# Altium schematic sheet Sheet1.SchDoc
size A
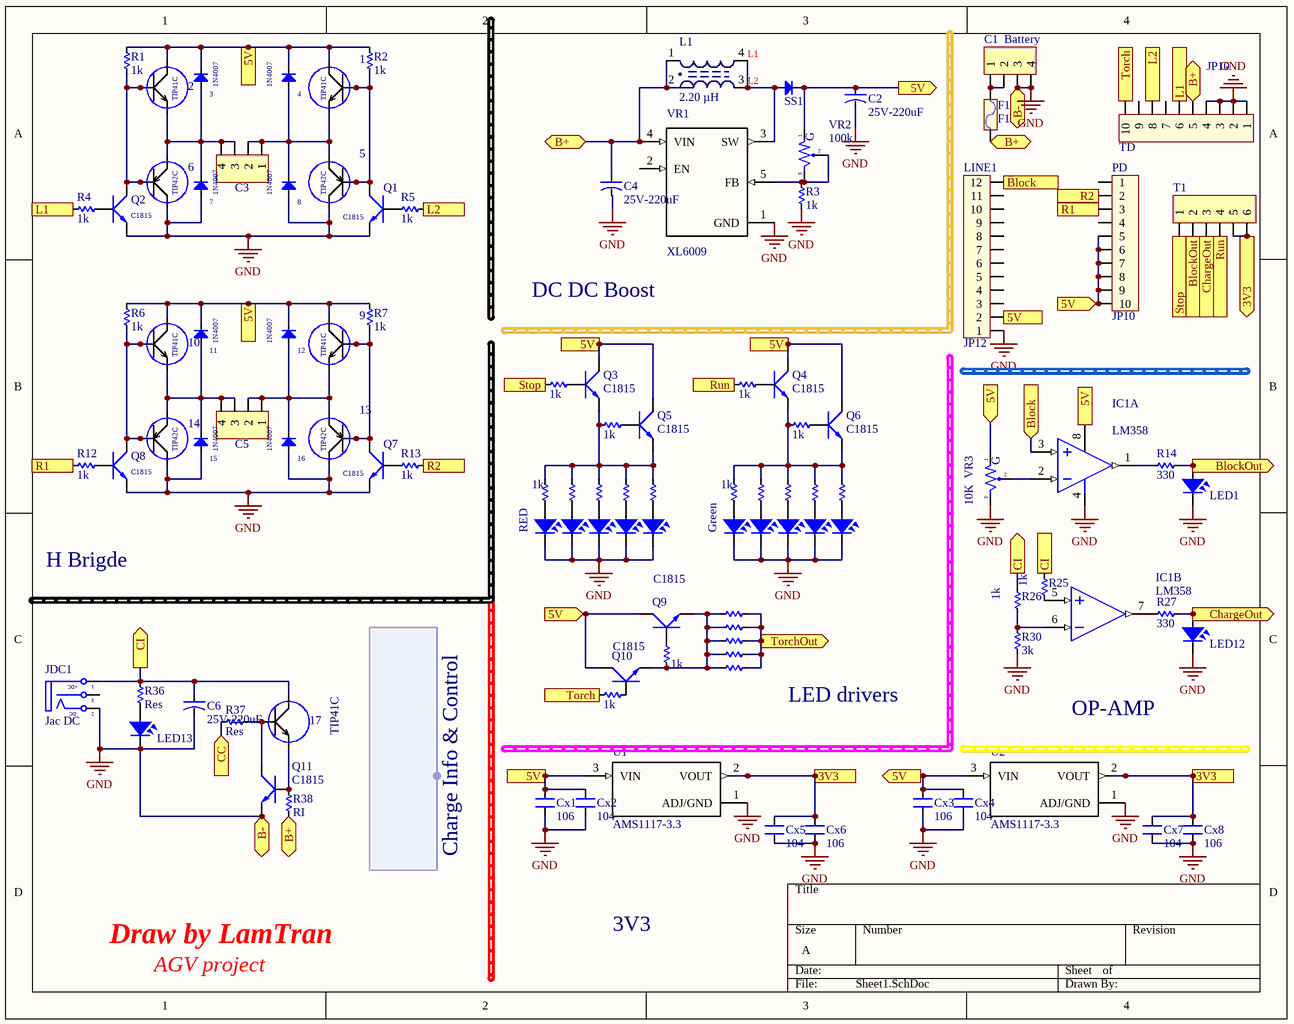
[diagram p0: Sheet1.SchDoc]

## Parts
1  TIP41C  [SC_TO-252AA]
2  TIP41C  [SC_TO-252AA]
3  1N4007  [DIO-SMD-106]
4  1N4007  [DIO-SMD-106]
5  TIP42C  [SC_TO-252AA]
6  TIP42C  [SC_TO-252AA]
7  1N4007  [DIO-SMD-106]
8  1N4007  [DIO-SMD-106]
9  TIP41C  [SC_TO-252AA]
10  TIP41C  [SC_TO-252AA]
11  1N4007  [DIO-SMD-106]
12  1N4007  [DIO-SMD-106]
13  TIP42C  [SC_TO-252AA]
14  TIP42C  [SC_TO-252AA]
15  1N4007  [DIO-SMD-106]
16  1N4007  [DIO-SMD-106]
17  TIP41C  [SC_TO-252AA]
C1  Battery  [Header4]
C2  25V-220uF  [CAP-ALU-SMD-6.3x7.7x2.2]
C3  Header4  [Header4]  (value not drawn)
C4  25V-220uF  [CAP-ALU-SMD-6.3x7.7x2.2]
C5  Header4  [Header4]  (value not drawn)
C6  25V-220uF  [CAP-ALU-SMD-6.3x7.7x2.2]
Cx1  106  [CN-SMD-0805]
Cx2  104  [CN-SMD-0805]
Cx3  106  [CN-SMD-0805]
Cx4  104  [CN-SMD-0805]
Cx5  104  [CN-SMD-0805]
Cx6  106  [CN-SMD-0805]
Cx7  104  [CN-SMD-0805]
Cx8  106  [CN-SMD-0805]
F1  F1A  [Fuse1]
IC1  LM358  [SO8]  (parts A,B of 2)
JDC1  Jac DC  [DC0]
L1  2.20 µH  [L-SMD-D-12.5x12.5]
LED1  LED  [LED-0805-Blue]  (value not drawn)
LED2  LED  [LED-0805-Red]  (value not drawn)
LED3  LED  [LED-0805-Red]  (value not drawn)
LED4  LED  [LED-0805-Red]  (value not drawn)
LED5  LED  [LED-0805-Red]  (value not drawn)
LED6  RED  [LED-0805-Red]
LED7  Green  [LED-0805-Red]
LED8  LED  [LED-0805-Red]  (value not drawn)
LED9  LED  [LED-0805-Red]  (value not drawn)
LED10  LED  [LED-0805-Red]  (value not drawn)
LED11  LED  [LED-0805-Red]  (value not drawn)
LED12  LED  [LED-0805-Blue]  (value not drawn)
LED13  LED  [LED-0805-Blue]  (value not drawn)
LINE1  JP12  [Header12]
PD  JP10  [Header10]
Q1  C1815  [SOT23B]
Q2  C1815  [SOT23B]
Q3  C1815  [SOT23B]
Q4  C1815  [SOT23B]
Q5  C1815  [SOT23B]
Q6  C1815  [SOT23B]
Q7  C1815  [SOT23B]
Q8  C1815  [SOT23B]
Q9  C1815  [SOT23B]
Q10  C1815  [SOT23B]
Q11  C1815  [SOT23B]
R1  1k  [RES-SMD-0805]
R2  1k  [RES-SMD-0805]
R3  1k  [RES-SMD-0805]
R4  1k  [RES-SMD-0805]
R5  1k  [RES-SMD-0805]
R6  1k  [RES-SMD-0805]
R7  1k  [RES-SMD-0805]
R8  1k  [RES-SMD-0805]
R9  1k  [RES-SMD-0805]
R10  1k  [RES-SMD-0805]
R11  1k  [RES-SMD-0805]
R12  1k  [RES-SMD-0805]
R13  1k  [RES-SMD-0805]
R14  330  [RES-SMD-0805]
R15  1k  [RES-SMD-0805]
R16  Res  [RES-SMD-0805]  (value not drawn)
R17  Res  [RES-SMD-0805]  (value not drawn)
R18  Res  [RES-SMD-0805]  (value not drawn)
R19  Res  [RES-SMD-0805]  (value not drawn)
R20  1k  [RES-SMD-0805]
R21  Res  [RES-SMD-0805]  (value not drawn)
R22  Res  [RES-SMD-0805]  (value not drawn)
R23  Res  [RES-SMD-0805]  (value not drawn)
R24  Res  [RES-SMD-0805]  (value not drawn)
R25  1k  [RES-SMD-0805]
R26  1k  [RES-SMD-0805]
R27  330  [RES-SMD-0805]
R28  Res  [RES-SMD-0805]  (value not drawn)
R29  Res  [RES-SMD-0805]  (value not drawn)
R30  3k  [RES-SMD-0805]
R31  1k  [RES-SMD-0805]
R32  Res  [RES-SMD-0805]  (value not drawn)
R33  Res  [RES-SMD-0805]  (value not drawn)
R34  Res  [RES-SMD-0805]  (value not drawn)
R35  1k  [RES-SMD-0805]
R36  Res  [RES-SMD-0805]
R37  Res  [RES-SMD-0805]
R38  RI  [RES-2W]
SS1  Diode SMD  [DIO-SMD-B]  (value not drawn)
T1  Header6  [HDR6]
TD  JP10  [Header10]
U1  AMS1117-3.3  [*SOT229P700X180-4N]
U2  AMS1117-3.3  [*SOT229P700X180-4N]
VR1  XL6009  [*DPAK170P1435X465-6N]
VR2  100k  [VR-S3]
VR3  10K  [VR-S3]

## Ports
3V3 (out), 5V (in), 5V (out), B+ (bidir), B- (bidir), Block (in), Block (out), BlockOut (out), CC (in), ChargeOut (out), CI (out), L1, L2, R1, R2, Run (in), Stop (in), Torch (in), TorchOut (out)

## Harnesses
Charge Info & Control: 

## Nets
GND: 5.2(C) 6.2(C) 7.1(A) 8.1(A) 13.2(C) 14.2(C) 15.1(A) 16.1(A) C1.3 C1.4 C2.2 C4.2 C6.2 Cx1.1 Cx2.1 Cx3.1 Cx4.1 Cx5.1 Cx6.1 Cx7.1 Cx8.1 IC1.4(-V) JDC1.2(TN) LED1.2 LED2.2 LED3.2 LED4.2 LED5.2 LED6.2 LED7.2 LED8.2 LED9.2 LED10.2 LED11.2 LED12.2 LED13.2 LINE1.1 Q1.1(E) Q2.1(E) Q7.1(E) Q8.1(E) Q11.1(E) R3.2 R30.2 TD.1 TD.2 TD.3 TD.4 U1.1(ADJ/GND) U2.1(ADJ/GND) VR1.1(GND) VR3.3 ; port B-
3V3: Cx5.2 Cx6.2 Cx7.2 Cx8.2 T1.5 T1.6 U1.2(VOUT) U2.2(VOUT) ; port 3V3
5V: 1.2(C) 2.2(C) 3.2(K) 4.2(K) 9.2(C) 10.2(C) 11.2(K) 12.2(K) C2.1 Cx1.2 Cx2.2 Cx3.2 Cx4.2 IC1.8(+V) LINE1.2 PD.5 PD.6 PD.7 PD.8 PD.9 PD.10 Q3.2(C) Q4.2(C) Q5.2(C) Q6.2(C) Q9.2(C) Q10.2(C) R1.1 R2.1 R6.1 R7.1 SS1.2(K) U1.3(VIN) U2.3(VIN) VR2.1 VR3.1 ; port 5V
B+: C4.1 F1.2 L1.1 L1.2 R38.2 TD.5 VR1.4(VIN) ; port B+
Block: IC1.3(IN+) LINE1.12 ; port Block
BlockOut: LED1.1 R14.1 T1.2 ; port BlockOut
CC: R37.2 ; port CC
ChargeOut: LED12.1 R27.1 T1.3 ; port ChargeOut
CI: 17.2(C) C6.1 JDC1.1(T) R25.1 R26.1 R36.1 ; port CI
L1: R4.1 TD.6 ; port L1
L2: R5.2 TD.8 ; port L2
R1: PD.3 R12.1 ; port R1
R2: PD.2 R13.2 ; port R2
Run: R9.1 T1.4 ; port Run
Stop: R8.1 T1.1 ; port Stop
Torch: R35.1 TD.10 ; port Torch
TorchOut: R28.2 R29.2 R32.2 R33.2 R34.2 ; port TorchOut
Net1_1: 1.1(B) 5.1(B) Q1.2(C) R2.2
Net1_3: 1.3(E) 4.1(A) 5.3(E) 8.2(K) C3.1 C3.2
Net2_1: 2.1(B) 6.1(B) Q2.2(C) R1.2
Net2_3: 2.3(E) 3.1(A) 6.3(E) 7.2(K) C3.3 C3.4
Net9_1: 9.1(B) 13.1(B) Q7.2(C) R7.2
Net9_3: 9.3(E) 12.1(A) 13.3(E) 16.2(K) C5.1 C5.2
Net10_1: 10.1(B) 14.1(B) Q8.2(C) R6.2
Net10_3: 10.3(E) 11.1(A) 14.3(E) 15.2(K) C5.3 C5.4
Net17_1: 17.1(B) Q11.2(C) R37.1
Net17_3: 17.3(E) Q11.3(B) R38.1
NetC1_1: C1.1 C1.2 F1.1
NetIC1_1: IC1.1(OUT) R14.2
NetIC1_2: IC1.2(IN-) VR3.2
NetIC1_5: IC1.5(IN+) R25.2
NetIC1_6: IC1.6(IN-) R26.2 R30.1
NetIC1_7: IC1.7(OUT) R27.2
NetL1_3: L1.3 L1.4 SS1.1(A) VR1.3(SW)
NetLED2_1: LED2.1 R18.2
NetLED3_1: LED3.1 R19.2
NetLED4_1: LED4.1 R23.2
NetLED5_1: LED5.1 R24.2
NetLED6_1: LED6.1 R15.2
NetLED7_1: LED7.1 R20.2
NetLED8_1: LED8.1 R16.2
NetLED9_1: LED9.1 R17.2
NetLED10_1: LED10.1 R21.2
NetLED11_1: LED11.1 R22.2
NetLED13_1: LED13.1 R36.2
NetQ1_3: Q1.3(B) R5.1
NetQ2_3: Q2.3(B) R4.2
NetQ3_1: Q3.1(E) Q5.1(E) R10.1 R15.1 R16.1 R17.1 R18.1 R19.1
NetQ3_3: Q3.3(B) R8.2
NetQ4_1: Q4.1(E) Q6.1(E) R11.1 R20.1 R21.1 R22.1 R23.1 R24.1
NetQ4_3: Q4.3(B) R9.2
NetQ5_3: Q5.3(B) R10.2
NetQ6_3: Q6.3(B) R11.2
NetQ7_3: Q7.3(B) R13.1
NetQ8_3: Q8.3(B) R12.2
NetQ9_1: Q9.1(E) Q10.1(E) R28.1 R29.1 R31.1 R32.1 R33.1 R34.1
NetQ9_3: Q9.3(B) R31.2
NetQ10_3: Q10.3(B) R35.2
NetR3_1: R3.1 VR1.5(FB) VR2.2 VR2.3

Not connected (* = marked no-connect by the designer): JDC1 3(S); LINE1 3 4 5 6 7 8 9 10 11; PD 1 4; TD 7 9; VR1 2(EN)

## Notes on the sheet
- DC DC Boost
- H Brigde
- LED drivers
- OP-AMP
- AGV project
- Draw by LamTran
- 3V3
- (in symbol DCIN) +DC; -DC
- (in symbol L-SMD-2) L2
- (in symbol VR-S) G

## Library data of the parts
3 4 7 8 11 12 15 16 SS1 = Diode SMD: Default Diode; Code - JEDEC: DO-214-AB; Value: 1N5007; Published: 8-Jun-2000; Revision: July-2002: Re-released for DXP Platform.; Publisher: Altium Limited
C1 C3 C5 = Header4: Header IDC, 4 x 1 Pin Vertical 2.54mm Pitch (Non-Boxed, Male); Manufacturer: W¨¹rth Elektronik eiSos GmbH; partNo: 613002143121; ComponentLink1 Description: Manufacturer; ComponentLink2 Description: Datasheet; NoPins: 02; Created Date: 29 March 2013; ComponentLink1URL: http://www.we-online.com; ComponentLink2URL: http://katalog.we-online.de/em/datasheet/6130xx143121.pdf; Created by: Karrer Zheng
C2 C4 C6 = CN-ALU-SMD: Polarized Capacitor (Axial); Published: 8-Jun-2000; LatestRevisionDate: 17-Jul-2002; LatestRevisionNote: Re-released for DXP Platform.; PackageReference: POLAR0.8; Publisher: Altium Limited
Cx1-Cx8 = CN: Value: 33pF
F1 = Fuse: Designed by: VanDungEvn; Value: Fuse
IC1 = LM358: Low-Power Dual Operational Amplifier; Value: LM358
JDC1 = DCIN: Jac DC input; Value: Jac DC
L1 = L-SMD-2: partNo: 7448709022; Manufacturer: Würth Elektronik eiSos GmbH; Inductance: 2.20 µH; ComponentLink1Description: Manufacturer; ComponentLink1URL: http://www.we-online.de; Created by: Christin Otto; Created Date: August 2013; ComponentLink2Description: Datasheet; ComponentLink2URL: http://katalog.we-online.de/pbs/datasheet/7448709022.pdf
LED1-LED13 = LED SMD: Value: LED 3 - 5 ly 2 Colour
LINE1 = Header12: Connector 12; Value: Connector 12
PD TD = Header10: Connector 10; Value: Connector 10
Q1-Q11 = C1815: NPN 600mW, ECB; Value: C1815
R1-R37 = Res-SMD: Resistor; Manufacturer: Generic Components; Class: Passive; Published: 08/06/2000; Publisher: Altium Hobart Technology Centre
R38 = Res: Manufacturer: Generic Components; Class: Passive; SubClass: R; Published: 08/06/2000; Publisher: Altium Hobart Technology Centre
T1 = Header6: Header IDC, 6 x 1 Pin Vertical 2.54mm Pitch (Non-Boxed, Male); Manufacturer: W¨¹rth Elektronik eiSos GmbH; partNo: 613002143121; ComponentLink1 Description: Manufacturer; ComponentLink2 Description: Datasheet; NoPins: 02; Created Date: 29 March 2013; ComponentLink1URL: http://www.we-online.com; ComponentLink2URL: http://katalog.we-online.de/em/datasheet/6130xx143121.pdf; Created by: Karrer Zheng
U1 U2 = AMS1117-3.3: Sot223/Pkg 1-Amp 3.3-Volt Low Drop Out Voltage Regulatator; MF: Advanced Monolithic Systems; Price: None; MP: AMS1117-3.3; SnapEDA_Link: https://www.snapeda.com/parts/AMS1117-3.3/Advanced%20Monolithic%20Systems/view-part/53450/?ref=snap; Availability: Unavailable; Package: None; Value: *
VR1 = XL6009: The XL6009 regulator is a wide input range, current mode, DC/DC converter which is capable of generating either positive or negative output voltages.; MF: XLSEMI; Package: Package Analog Devices; MP: XL6009; Price: None; Availability: Unavailable; SnapEDA_Link: https://www.snapeda.com/parts/XL6009/XLSEMI/view-part/3211005/?ref=snap; Value: *
VR2 VR3 = VR-S: Var Resistor; Value: Volume 50k